# Altium schematic sheet DAC.SchDoc
size A4; SheetNumber: 5; SheetTotal: 6
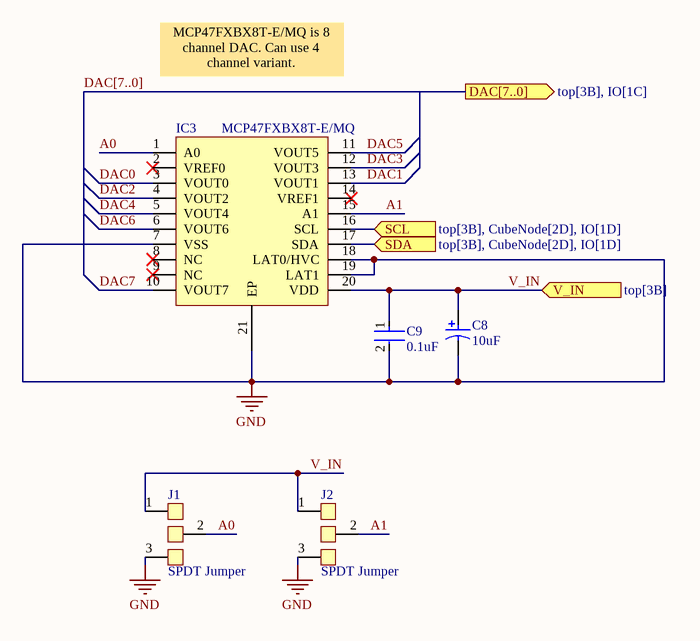
[diagram p0: DAC.SchDoc]

## Parts
C8  10uF  [KEMT-A-3216-18-2_M]
C9  0.1uF  [FP-GRM033-0_03-MFG]
IC3  MCP47FXBX8T-E/MQ  [MCP47FXBX8T-E/MQ]
J1  SPDT Jumper  [SPDT Jumper]
J2  SPDT Jumper  [SPDT Jumper]

## Ports
DAC[7..0] (out, see top[3B], IO[1C]), SCL (in, see top[3B], CubeNode[2D], IO[1D]), SDA (in, see top[3B], CubeNode[2D], IO[1D]), V_IN (in, see top[3B])

## Nets
GND: C8.2 C9.2 IC3.7(VSS) IC3.18(LAT0/HVC) IC3.19(LAT1) IC3.21(EP) J1.3 J2.3
A0: IC3.1(A0) J1.2
A1: IC3.15(A1) J2.2
DAC0: IC3.3(VOUT0)
DAC1: IC3.13(VOUT1)
DAC2: IC3.4(VOUT2)
DAC3: IC3.12(VOUT3)
DAC4: IC3.5(VOUT4)
DAC5: IC3.11(VOUT5)
DAC6: IC3.6(VOUT6)
DAC7: IC3.10(VOUT7)
SCL: IC3.16(SCL) ; port SCL
SDA: IC3.17(SDA) ; port SDA
V_IN: C8.1 C9.1 IC3.20(VDD) J1.1 J2.1 ; port V_IN

Not connected (* = marked no-connect by the designer): IC3 2(VREF0)* 8(NC)* 9(NC)* 14(VREF1)*

## Buses and harness runs
bus DAC[7..0] = port DAC[7..0]

## Notes on the sheet
- MCP47FXBX8T-E/MQ is 8 channel DAC. Can use 4 channel variant.

## Library data of the parts
C8 = CMP-2000-05172-1: Capacitor, Tantalum, 10 uF, +/- 10%, 10 V, -55 to 125 degC, 2-Pin SMD (1206), RoHS, Tape and Reel; Manufacturer Size Code: A; Manufacturer: Kemet; Type: Molded; Online Catalog: T491Series; Other Names: 399-3684-2; Voltage - Rated: 10V; Lifetime @ Temp.: 2000Hrs@85degC; Product Training Modules: CapacitorBasics-TypicalUsesforCapacitorsDeratingGuidelinesforSurfaceMountTantalumCapacitors; ESR (Equivalent Series Resistance): 3.8Ohm; Capacitance: 10µF; Catalog Drawings: T49x,T5xxSeries_A-side1T49x,T5xxSeries_A,B-side2T49x,T5xxSeries_A,SBottom; Family: TantalumCapacitors; Manufacturer URL: http://www.kemet.com/; Datasheet URL: http://www.farnell.com/datasheets/1824869.pdf; Package Reference: 1206; Packaging: Tape&Reel(TR); Series: T491; Operating Temperature: -55degC~125degC; Mounting Type: SurfaceMount; Height - Seated (Max): 0.071"(1.80mm); Package / Case: 1206(3216Metric); Package Description: 2-Pin Surface Mount Device, Body 3.2 x 1.6 mm; Features: GeneralPurpose; Tolerance: ±10%; Lead Spacing: -; Size / Dimension: 0.126"Lx0.063"W(3.20mmx1.60mm); Standard Package: 2,000; Datasheet Version: Apr-14; Category: Capacitors
C9 = CMP-06035-000062-2: Chip Multilayer Ceramic Capacitors for General Purpose, 0201, 0.10uF, X5R, 15%, 10%, 6.3V; Capacitance: 100nF; Min Operating Temperature: -55°C; Lead Free: Lead Free; Radiation Hardening: No; Dielectric: X5R; Voltage Rating (DC): 6.3V; REACH SVHC: No SVHC; Case/Package: 0201; Voltage Rating: 6.3V; Length: 0.6mm; Max Operating Temperature: 85°C; Width: 0.012inch; Depth: 0.3mm; Material: Ceramic; Case Code (Metric): 0603; Thickness: 0.013inch; Packaging: Tape and Reel; Height: 0.3mm; Weight: 6E-06oz; Package Quantity: 1; Mount: Surface Mount; Voltage: 6.3V; Case Code (Imperial): 0201; Tolerance: 10%; Termination: SMD/SMT